# Altium schematic sheet KEY_Pad.SchDoc
size A3
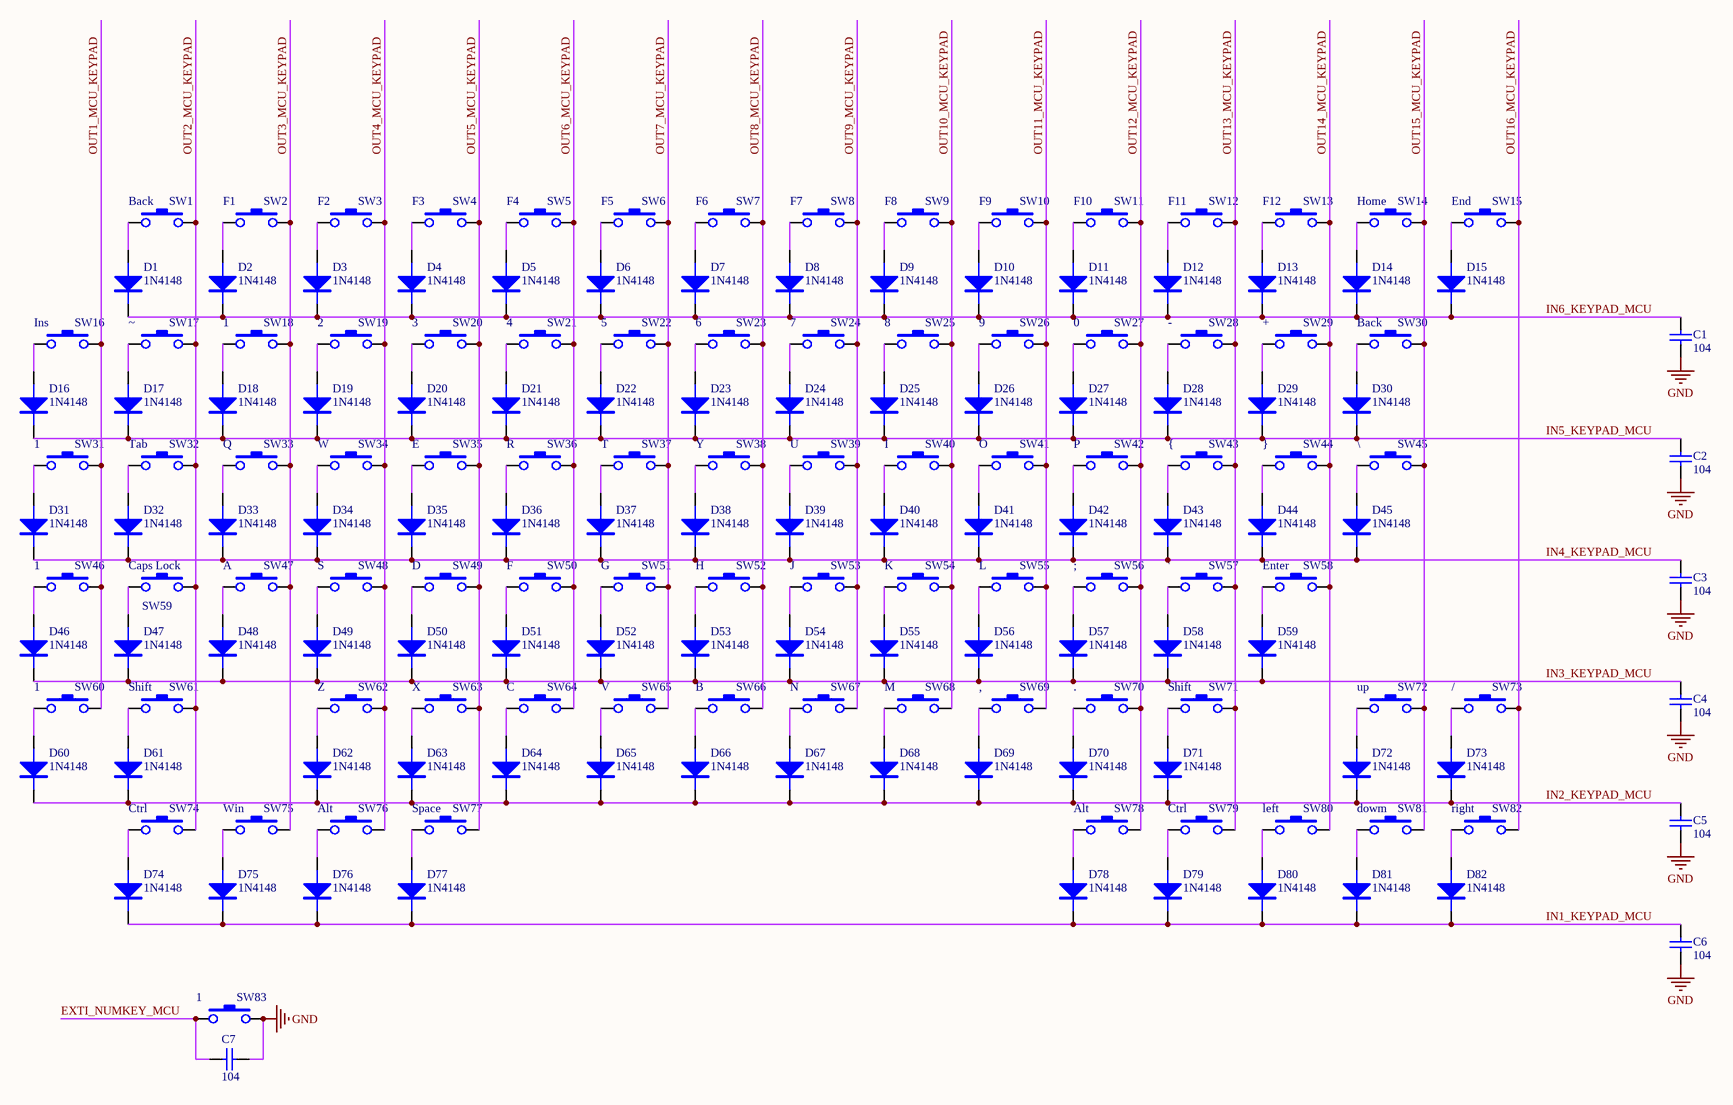
[diagram p0: KEY_Pad.SchDoc]

## Parts
C1  104  [Cap-0603]
C2  104  [Cap-0603]
C3  104  [Cap-0603]
C4  104  [Cap-0603]
C5  104  [Cap-0603]
C6  104  [Cap-0603]
C7  104  [Cap-0603]
D1  1N4148  [SOD-523]
D2  1N4148  [SOD-523]
D3  1N4148  [SOD-523]
D4  1N4148  [SOD-523]
D5  1N4148  [SOD-523]
D6  1N4148  [SOD-523]
D7  1N4148  [SOD-523]
D8  1N4148  [SOD-523]
D9  1N4148  [SOD-523]
D10  1N4148  [SOD-523]
D11  1N4148  [SOD-523]
D12  1N4148  [SOD-523]
D13  1N4148  [SOD-523]
D14  1N4148  [SOD-523]
D15  1N4148  [SOD-523]
D16  1N4148  [SOD-523]
D17  1N4148  [SOD-523]
D18  1N4148  [SOD-523]
D19  1N4148  [SOD-523]
D20  1N4148  [SOD-523]
D21  1N4148  [SOD-523]
D22  1N4148  [SOD-523]
D23  1N4148  [SOD-523]
D24  1N4148  [SOD-523]
D25  1N4148  [SOD-523]
D26  1N4148  [SOD-523]
D27  1N4148  [SOD-523]
D28  1N4148  [SOD-523]
D29  1N4148  [SOD-523]
D30  1N4148  [SOD-523]
D31  1N4148  [SOD-523]
D32  1N4148  [SOD-523]
D33  1N4148  [SOD-523]
D34  1N4148  [SOD-523]
D35  1N4148  [SOD-523]
D36  1N4148  [SOD-523]
D37  1N4148  [SOD-523]
D38  1N4148  [SOD-523]
D39  1N4148  [SOD-523]
D40  1N4148  [SOD-523]
D41  1N4148  [SOD-523]
D42  1N4148  [SOD-523]
D43  1N4148  [SOD-523]
D44  1N4148  [SOD-523]
D45  1N4148  [SOD-523]
D46  1N4148  [SOD-523]
D47  1N4148  [SOD-523]
D48  1N4148  [SOD-523]
D49  1N4148  [SOD-523]
D50  1N4148  [SOD-523]
D51  1N4148  [SOD-523]
D52  1N4148  [SOD-523]
D53  1N4148  [SOD-523]
D54  1N4148  [SOD-523]
D55  1N4148  [SOD-523]
D56  1N4148  [SOD-523]
D57  1N4148  [SOD-523]
D58  1N4148  [SOD-523]
D59  1N4148  [SOD-523]
D60  1N4148  [SOD-523]
D61  1N4148  [SOD-523]
D62  1N4148  [SOD-523]
D63  1N4148  [SOD-523]
D64  1N4148  [SOD-523]
D65  1N4148  [SOD-523]
D66  1N4148  [SOD-523]
D67  1N4148  [SOD-523]
D68  1N4148  [SOD-523]
D69  1N4148  [SOD-523]
D70  1N4148  [SOD-523]
D71  1N4148  [SOD-523]
D72  1N4148  [SOD-523]
D73  1N4148  [SOD-523]
D74  1N4148  [SOD-523]
D75  1N4148  [SOD-523]
D76  1N4148  [SOD-523]
D77  1N4148  [SOD-523]
D78  1N4148  [SOD-523]
D79  1N4148  [SOD-523]
D80  1N4148  [SOD-523]
D81  1N4148  [SOD-523]
D82  1N4148  [SOD-523]
SW1  Back  [MX_SW-4]
SW2  F1  [MX_SW-4]
SW3  F2  [MX_SW-4]
SW4  F3  [MX_SW-4]
SW5  F4  [MX_SW-4]
SW6  F5  [MX_SW-4]
SW7  F6  [MX_SW-4]
SW8  F7  [MX_SW-4]
SW9  F8  [MX_SW-4]
SW10  F9  [MX_SW-4]
SW11  F10  [MX_SW-4]
SW12  F11  [MX_SW-4]
SW13  F12  [MX_SW-4]
SW14  Home  [MX_SW-4]
SW15  End  [MX_SW-4]
SW16  Ins  [MX_SW-4]
SW17  ~  [MX_SW-4]
SW18  1  [MX_SW-4]
SW19  2  [MX_SW-4]
SW20  3  [MX_SW-4]
SW21  4  [MX_SW-4]
SW22  5  [MX_SW-4]
SW23  6  [MX_SW-4]
SW24  7  [MX_SW-4]
SW25  8  [MX_SW-4]
SW26  9  [MX_SW-4]
SW27  0  [MX_SW-4]
SW28  -  [MX_SW-4]
SW29  +  [MX_SW-4]
SW30  Back  [MX_SW-4]
SW31  1  [MX_SW-4]
SW32  Tab  [MX_SW-4]
SW33  Q  [MX_SW-4]
SW34  W  [MX_SW-4]
SW35  E  [MX_SW-4]
SW36  R  [MX_SW-4]
SW37  T  [MX_SW-4]
SW38  Y  [MX_SW-4]
SW39  U  [MX_SW-4]
SW40  I  [MX_SW-4]
SW41  O  [MX_SW-4]
SW42  P  [MX_SW-4]
SW43  {  [MX_SW-4]
SW44  }  [MX_SW-4]
SW45  \  [MX_SW-4]
SW46  1  [MX_SW-4]
SW47  A  [MX_SW-4]
SW48  S  [MX_SW-4]
SW49  D  [MX_SW-4]
SW50  F  [MX_SW-4]
SW51  G  [MX_SW-4]
SW52  H  [MX_SW-4]
SW53  J  [MX_SW-4]
SW54  K  [MX_SW-4]
SW55  L  [MX_SW-4]
SW56  ;  [MX_SW-4]
SW57  '  [MX_SW-4]
SW58  Enter  [MX_SW-4]
SW59  Caps Lock  [MX_SW-4]
SW60  1  [MX_SW-4]
SW61  Shift  [MX_SW-4]
SW62  Z  [MX_SW-4]
SW63  X  [MX_SW-4]
SW64  C  [MX_SW-4]
SW65  V  [MX_SW-4]
SW66  B  [MX_SW-4]
SW67  N  [MX_SW-4]
SW68  M  [MX_SW-4]
SW69  ,  [MX_SW-4]
SW70  .  [MX_SW-4]
SW71  Shift  [MX_SW-4]
SW72  up  [MX_SW-4]
SW73  /  [MX_SW-4]
SW74  Ctrl  [MX_SW-4]
SW75  Win  [MX_SW-4]
SW76  Alt  [MX_SW-4]
SW77  Space  [MX_SW-4]
SW78  Alt  [MX_SW-4]
SW79  Ctrl  [MX_SW-4]
SW80  left  [MX_SW-4]
SW81  dowm  [MX_SW-4]
SW82  right  [MX_SW-4]
SW83  1  [MX_SW-4]

## Nets
GND: C1.2 C2.2 C3.2 C4.2 C5.2 C6.2 C7.2 SW83.2
EXTI_NUMKEY_MCU: C7.1 SW83.1
IN1_KEYPAD_MCU: C6.1 D74.K D75.K D76.K D77.K D78.K D79.K D80.K D81.K D82.K
IN2_KEYPAD_MCU: C5.1 D60.K D61.K D62.K D63.K D64.K D65.K D66.K D67.K D68.K D69.K D70.K D71.K D72.K D73.K
IN3_KEYPAD_MCU: C4.1 D46.K D47.K D48.K D49.K D50.K D51.K D52.K D53.K D54.K D55.K D56.K D57.K D58.K D59.K
IN4_KEYPAD_MCU: C3.1 D31.K D32.K D33.K D34.K D35.K D36.K D37.K D38.K D39.K D40.K D41.K D42.K D43.K D44.K D45.K
IN5_KEYPAD_MCU: C2.1 D16.K D17.K D18.K D19.K D20.K D21.K D22.K D23.K D24.K D25.K D26.K D27.K D28.K D29.K D30.K
IN6_KEYPAD_MCU: C1.1 D1.K D2.K D3.K D4.K D5.K D6.K D7.K D8.K D9.K D10.K D11.K D12.K D13.K D14.K D15.K
OUT1_MCU_KEYPAD: SW16.2 SW31.2 SW46.2 SW60.2
OUT2_MCU_KEYPAD: SW1.2 SW17.2 SW32.2 SW59.2 SW61.2 SW74.2
OUT3_MCU_KEYPAD: SW2.2 SW18.2 SW33.2 SW47.2 SW75.2
OUT4_MCU_KEYPAD: SW3.2 SW19.2 SW34.2 SW48.2 SW62.2 SW76.2
OUT5_MCU_KEYPAD: SW4.2 SW20.2 SW35.2 SW49.2 SW63.2 SW77.2
OUT6_MCU_KEYPAD: SW5.2 SW21.2 SW36.2 SW50.2 SW64.2
OUT7_MCU_KEYPAD: SW6.2 SW22.2 SW37.2 SW51.2 SW65.2
OUT8_MCU_KEYPAD: SW7.2 SW23.2 SW38.2 SW52.2 SW66.2
OUT9_MCU_KEYPAD: SW8.2 SW24.2 SW39.2 SW53.2 SW67.2
OUT10_MCU_KEYPAD: SW9.2 SW25.2 SW40.2 SW54.2 SW68.2
OUT11_MCU_KEYPAD: SW10.2 SW26.2 SW41.2 SW55.2 SW69.2
OUT12_MCU_KEYPAD: SW11.2 SW27.2 SW42.2 SW56.2 SW70.2 SW78.2
OUT13_MCU_KEYPAD: SW12.2 SW28.2 SW43.2 SW57.2 SW71.2 SW79.2
OUT14_MCU_KEYPAD: SW13.2 SW29.2 SW44.2 SW58.2 SW80.2
OUT15_MCU_KEYPAD: SW14.2 SW30.2 SW45.2 SW72.2 SW81.2
OUT16_MCU_KEYPAD: SW15.2 SW73.2 SW82.2
NetD1_A: D1.A SW1.1
NetD2_A: D2.A SW2.1
NetD3_A: D3.A SW3.1
NetD4_A: D4.A SW4.1
NetD5_A: D5.A SW5.1
NetD6_A: D6.A SW6.1
NetD7_A: D7.A SW7.1
NetD8_A: D8.A SW8.1
NetD9_A: D9.A SW9.1
NetD10_A: D10.A SW10.1
NetD11_A: D11.A SW11.1
NetD12_A: D12.A SW12.1
NetD13_A: D13.A SW13.1
NetD14_A: D14.A SW14.1
NetD15_A: D15.A SW15.1
NetD16_A: D16.A SW16.1
NetD17_A: D17.A SW17.1
NetD18_A: D18.A SW18.1
NetD19_A: D19.A SW19.1
NetD20_A: D20.A SW20.1
NetD21_A: D21.A SW21.1
NetD22_A: D22.A SW22.1
NetD23_A: D23.A SW23.1
NetD24_A: D24.A SW24.1
NetD25_A: D25.A SW25.1
NetD26_A: D26.A SW26.1
NetD27_A: D27.A SW27.1
NetD28_A: D28.A SW28.1
NetD29_A: D29.A SW29.1
NetD30_A: D30.A SW30.1
NetD31_A: D31.A SW31.1
NetD32_A: D32.A SW32.1
NetD33_A: D33.A SW33.1
NetD34_A: D34.A SW34.1
NetD35_A: D35.A SW35.1
NetD36_A: D36.A SW36.1
NetD37_A: D37.A SW37.1
NetD38_A: D38.A SW38.1
NetD39_A: D39.A SW39.1
NetD40_A: D40.A SW40.1
NetD41_A: D41.A SW41.1
NetD42_A: D42.A SW42.1
NetD43_A: D43.A SW43.1
NetD44_A: D44.A SW44.1
NetD45_A: D45.A SW45.1
NetD46_A: D46.A SW46.1
NetD47_A: D47.A SW59.1
NetD48_A: D48.A SW47.1
NetD49_A: D49.A SW48.1
NetD50_A: D50.A SW49.1
NetD51_A: D51.A SW50.1
NetD52_A: D52.A SW51.1
NetD53_A: D53.A SW52.1
NetD54_A: D54.A SW53.1
NetD55_A: D55.A SW54.1
NetD56_A: D56.A SW55.1
NetD57_A: D57.A SW56.1
NetD58_A: D58.A SW57.1
NetD59_A: D59.A SW58.1
NetD60_A: D60.A SW60.1
NetD61_A: D61.A SW61.1
NetD62_A: D62.A SW62.1
NetD63_A: D63.A SW63.1
NetD64_A: D64.A SW64.1
NetD65_A: D65.A SW65.1
NetD66_A: D66.A SW66.1
NetD67_A: D67.A SW67.1
NetD68_A: D68.A SW68.1
NetD69_A: D69.A SW69.1
NetD70_A: D70.A SW70.1
NetD71_A: D71.A SW71.1
NetD72_A: D72.A SW72.1
NetD73_A: D73.A SW73.1
NetD74_A: D74.A SW74.1
NetD75_A: D75.A SW75.1
NetD76_A: D76.A SW76.1
NetD77_A: D77.A SW77.1
NetD78_A: D78.A SW78.1
NetD79_A: D79.A SW79.1
NetD80_A: D80.A SW80.1
NetD81_A: D81.A SW81.1
NetD82_A: D82.A SW82.1

## Notes on the sheet
- Title
- Size:
- Date:
- A3
- Number:
- Time:
- Revision:
- Sheet
- of
- File:

## Library data of the parts
C1-C7 = CAP: 贴片陶瓷电容
D1-D82 = DIODE: 普通二极管
SW1-SW83 = MX_SW-4: with Fixation pins  1-Pole